# Altium project Midas.PrjPcb
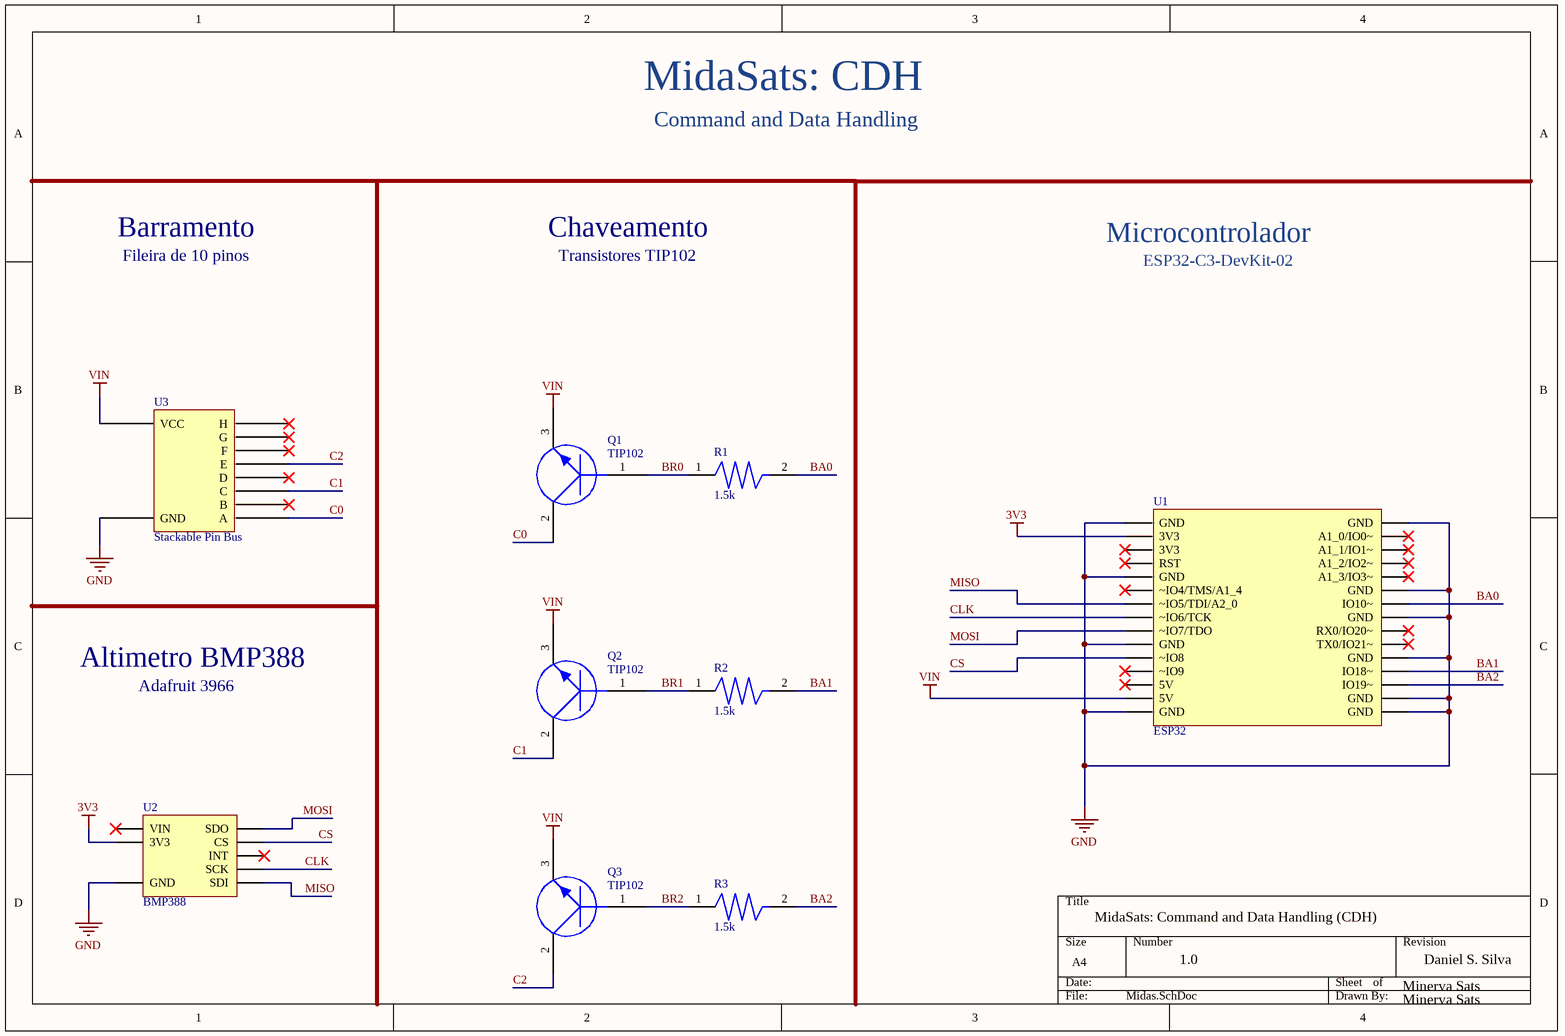
[diagram p0: Midas.SchDoc]
1 sheet, 9 parts. Net scope: global (net labels, ports and power ports of the same name join across sheets).
Board file: Midas.PcbDoc

## Sheet Midas.SchDoc
size A4; SheetNumber: 1; SheetTotal: 1

### Parts
Q1  TIP102  [ONSC-TO-220-3-221A-09]
Q2  TIP102  [ONSC-TO-220-3-221A-09]
Q3  TIP102  [ONSC-TO-220-3-221A-09]
R1  1.5k  [CF18JT1K50]
R2  1.5k  [CF18JT1K50]
R3  1.5k  [CF18JT1K50]
U1  ESP32  [ESP32]
U2  BMP388  [3966]
U3  Stackable Pin Bus  [STACKABLE_PIN_BUS]

### Nets
3V3: U1.2(3V3) U2.2(3V3)
GND: U1.1(GND) U1.5(GND) U1.10(GND) U1.15(GND) U1.16(GND) U1.17(GND) U1.20(GND) U1.23(GND) U1.25(GND) U1.30(GND) U2.3(GND) U3.2(GND)
VIN: Q1.3(E) Q2.3(E) Q3.3(E) U1.14(5V) U3.1(VCC)
BA0: R1.2 U1.24(IO10~)
BA1: R2.2 U1.19(IO18~)
BA2: R3.2 U1.18(IO19~)
BR0: Q1.1(B) R1.1
BR1: Q2.1(B) R2.1
BR2: Q3.1(B) R3.1
C0: Q1.2(C) U3.3(A)
C1: Q2.2(C) U3.5(C)
C2: Q3.2(C) U3.7(E)
CLK: U1.8(~IO6/TCK) U2.4(SCK)
CS: U1.11(~IO8) U2.7(CS)
MISO: U1.7(~IO5/TDI/A2_0) U2.6(SDI)
MOSI: U1.9(~IO7/TDO) U2.5(SDO)

Not connected (* = marked no-connect by the designer): U1 3(3V3)* 4(RST)* 6(~IO4/TMS/A1_4)* 12(~IO9)* 13(5V)* 21(TX0/IO21~)* 22(RX0/IO20~)* 26(A1_3/IO3~)* 27(A1_2/IO2~)* 28(A1_1/IO1~)* 29(A1_0/IO0~)*; U2 1(VIN)* 8(INT)*; U3 4(B)* 6(D)* 8(F)* 9(G)* 10(H)*

### Notes on the sheet
- MidaSats: CDH
- Command and Data Handling
- Barramento
- Chaveamento
- Microcontrolador
- Fileira de 10 pinos
- Transistores TIP102
- ESP32-C3-DevKit-02
- Altimetro BMP388
- Adafruit 3966
- MidaSats: Command and Data Handling (CDH)
- 1.0
- Minerva Sats
- Daniel S. Silva

### Library data of the parts
R1-R3 = CF18JT1K50
U1 = ESP32-C3-DEVKITC-02: Manufacturer: Espressif Systems; Supplier: Digikey; Supplier Part Number: 1965-ESP32-C3-DEVKITC-02-ND; Manufacturer Part Number: ESP32-C3-DEVKITC-02; RoHS: No; Category: RF Semiconductors and Devices; Stock: 1074; Pricing: 1=8 (USD)
U2 = 3966: Test Lead, Blk, Red, 139.7MM, 500V 3V ~ 5V / Adafruit Industries LLC / BMP388 - Pressure Sensor Evaluation Board / BMP388; Supplier: Digikey; Supplier Part Number: 1528-2733-ND; Manufacturer: Adafruit Industries; Manufacturer Part Number: 3966; RoHS: No; Category: Pressure Sensors; Stock: 21; Pricing: 1=9,95 (USD)
U3 = Barramento Empilhável: 10 pinos, Passo 2.54mm, Dimensões da barra 26x2x8mm